# EAGLE design Color2018 (EAGLE 9.0.1)
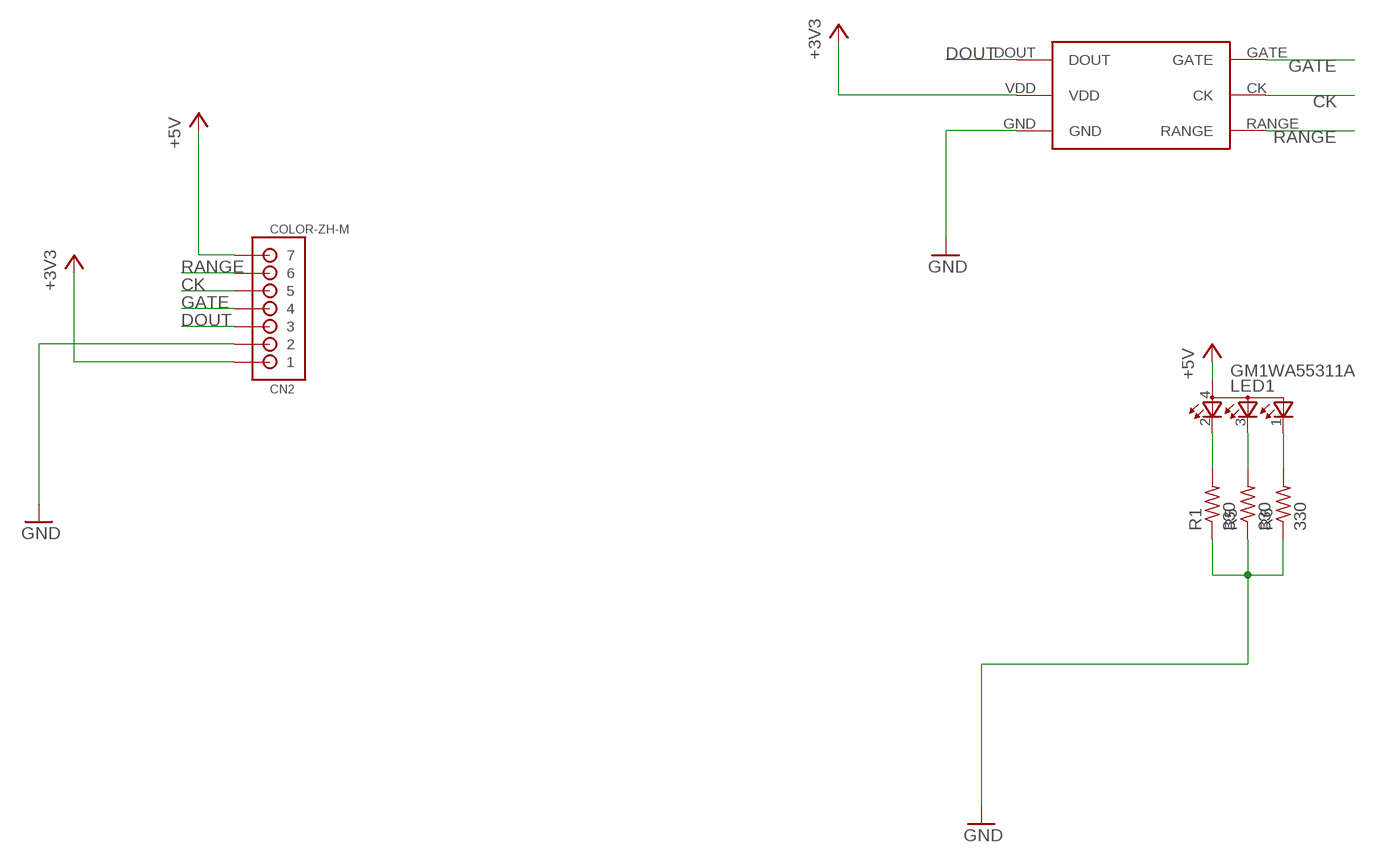
[diagram p0: schematic, sheet 1]

## Parts
CN2  COLOR-ZH-M  B7B-ZR  [B7B-ZR]
LED1  GM1WA55311A  [GM1WA55311A]
R1  330  R-US_R0805  [R0805]
R5  330  R-US_R0805  [R0805]
R6  330  R-US_R0805  [R0805]
U$1  S9706  [S9706]

## Nets
+3V3: CN2.1 U$1.VDD
+5V: CN2.7 LED1.4(A)
CK: CN2.5 U$1.CK
DOUT: CN2.3 U$1.DOUT
GATE: CN2.4 U$1.GATE
GND: CN2.2 R1.1 R5.1 R6.1 U$1.GND
N$1: LED1.2(CRED) R1.2
N$2: LED1.3(CBLUE) R5.2
N$3: LED1.1(CGREEN) R6.2
RANGE: CN2.6 U$1.RANGE

## Library data of the parts
CN2 = jst:B7B-ZR
LED1 = led:GM1WA55311A: Chip LED RGB Source: http://document.sharpsma.com/files/GM1WA55311A_SS.pdf
R1 R5 R6 = 0@Mylibrary-main1:R-US_: RESISTOR, American symbol
U$1 = S9706:S9706

## Board
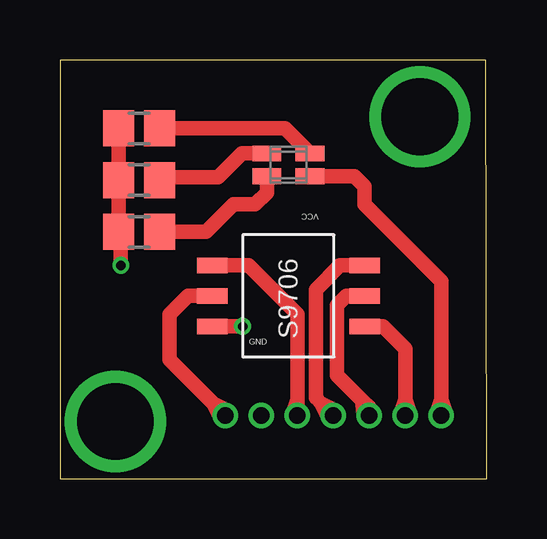
[diagram p1: board, top side]
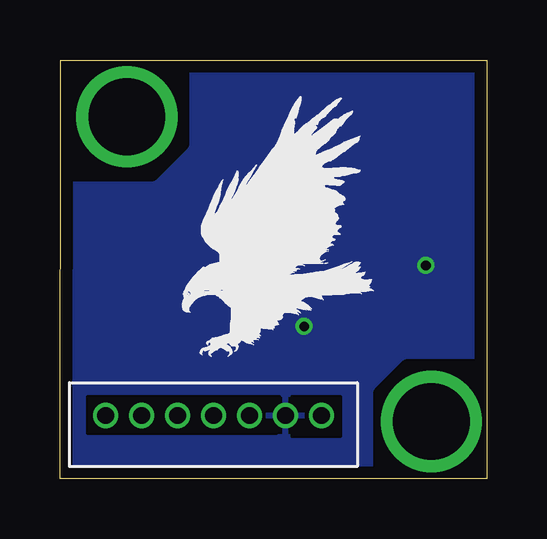
[diagram p2: board, bottom side, seen from below]

Size 17.8 x 17.45 mm. Coordinates in mm from the lower left corner, seen from the top.
Outline: 0,0 17.8,0 17.76,17.45 0,17.45 0,0
Copper layers (1*16): Top 0.035mm / dielectric 1.6mm / Bottom 0.035mm
Design rules "Elecrow_2-layer_PCB_eagle_rule": minimum track width 6mil, minimum drill 12mil, track to track 6mil, track to pad 6mil, pad to pad 6mil, via to via 8mil, smd to smd 0mil, copper to edge 20mil, drill to drill 10mil, minimum pad ring 6mil, minimum via ring 6mil, stop-mask expansion 0mil, vias tented up to drill 100mil, thermal gap 10mil
bRestrict: 12 lines

### Footprints (pad centres in the part's own frame; a part is rotated, then mirrored left to right if it is on the bottom)
B7B-ZR = drill 0.7: 1 10.5,-1.3; 2 9,-1.3; 3 7.5,-1.3; 4 6,-1.3; 5 4.5,-1.3; 6 3,-1.3; 7 1.5,-1.3
GM1WA55311A = smd 0.65 x 1.2: 1 -0.475,0.9; 2 -0.475,-0.9; 3 0.475,-0.9; 4 0.475,0.9
R0805 = smd 1.3 x 1.5: 1 -0.85,0; 2 0.85,0
S9706 = smd 1.27 x 0.635: CK 7.62,3.81; DOUT 1.27,5.08; GATE 7.62,5.08; GND 1.27,2.54; RANGE 7.62,2.54; VDD 1.27,3.81

### Placement (x,y rotation side)
CN2  17.4,3.94 0 bottom
LED1  9.53,13.08 270 top
R1  3.3,12.45 0 top
R5  3.3,10.29 0 top
R6  3.3,14.61 0 top
U$1  5.08,3.81 0 top
U$2  [EAGLE-PLC-8MM]  12.7,5.08 0 bottom

### Tracks (layer width: path | path; a pad name or v marks a point on that pad's centre or on a via)
+3V3
  Top 0.61: CN2.1 6.4,3.13 | 6.4,3.13 4.57,4.96 4.57,6.86 5.33,7.62 U$1.VDD | 6.4,3.13 6.7,2.54 CN2.1 | 6.4,3.13 7,2.83 CN2.1
+5V
  Top 0.61: CN2.7 15.9,3.34 | 15.9,3.34 15.9,8.23 12.7,11.43 12.7,12.19 12.29,12.61 LED1.4 | 15.9,3.34 15.69,2.71 CN2.7 | 15.9,3.34 16.11,2.71 CN2.7
CK
  Top 0.61: U$1.CK 11.94,7.62 11.56,7.24 11.56,4.32 12.6,3.27 | 12.6,3.27 12.9,2.98 CN2.5 | 12.6,3.27 12.68,2.61 CN2.5 | 12.6,3.27 13.06,2.79 CN2.5
DOUT
  Top 0.61: U$1.DOUT 7.87,8.89 9.9,6.87 9.9,3.34 | 9.9,3.34 CN2.3 9.69,2.71 9.9,3.34
GATE
  Top 0.61: CN2.4 10.9,3.13 | 10.9,3.13 10.67,3.37 10.67,7.87 11.68,8.89 U$1.GATE | 10.9,3.13 11.2,2.54 CN2.4 | 10.9,3.13 11.5,2.83 CN2.4
GND  (via drill 0.4)
  Top 0.61: U$1.GND v7.62,6.35 | R6.1 R1.1 R5.1 2.54,10.2 v2.54,8.89
  pour Bottom: 0,17.78 17.78,17.78 17.78,0 0,0
N$1
  Top 0.61: LED1.2 7.59,13.56 6.6,12.57 4.28,12.57 R1.2
N$2
  Top 0.61: R5.2 6.1,10.29 7.24,11.43 8.13,11.43 8.62,11.93 LED1.3
N$3
  Top 0.61: LED1.1 9.38,14.61 R6.2
N$4  (via drill 3.2 pad 0.25)
  other vias: 2.31,2.39
N$45  (via drill 3.2 pad 0.25)
  other vias: 15.01,15.09
RANGE
  Top 0.61: U$1.RANGE 13.46,6.35 14.4,5.41 14.4,3.34 | 14.4,3.34 CN2.6 | 14.4,3.34 14.19,2.71 CN2.6 | 14.4,3.34 14.61,2.71 CN2.6

### Text on the board
tNames: VCC | GND
tValues: Designed by Aquila | 2018
bValues: Project Aquila